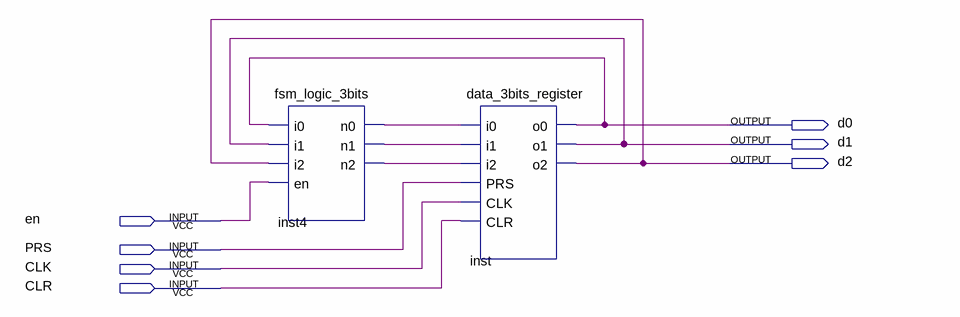
[diagram p0: schematic sheet]
// Quartus schematic state_3bits_ctler.bdf as structural Verilog: 2 symbols, 7 pins
module state_3bits_ctler (
  input  en,
  input  PRS,
  input  CLK,
  input  CLR,
  output d0,
  output d1,
  output d2
);

  wire inst4_n0, inst4_n1, inst4_n2;

  fsm_logic_3bits inst4 (.i0(d0), .i1(d1), .i2(d2), .en(en), .n0(inst4_n0), .n1(inst4_n1), .n2(inst4_n2));
  data_3bits_register inst (
    .i0(inst4_n0), .i1(inst4_n1), .i2(inst4_n2), .PRS(PRS), .CLK(CLK), .CLR(CLR), .o0(d0), .o1(d1), .o2(d2));
endmodule
